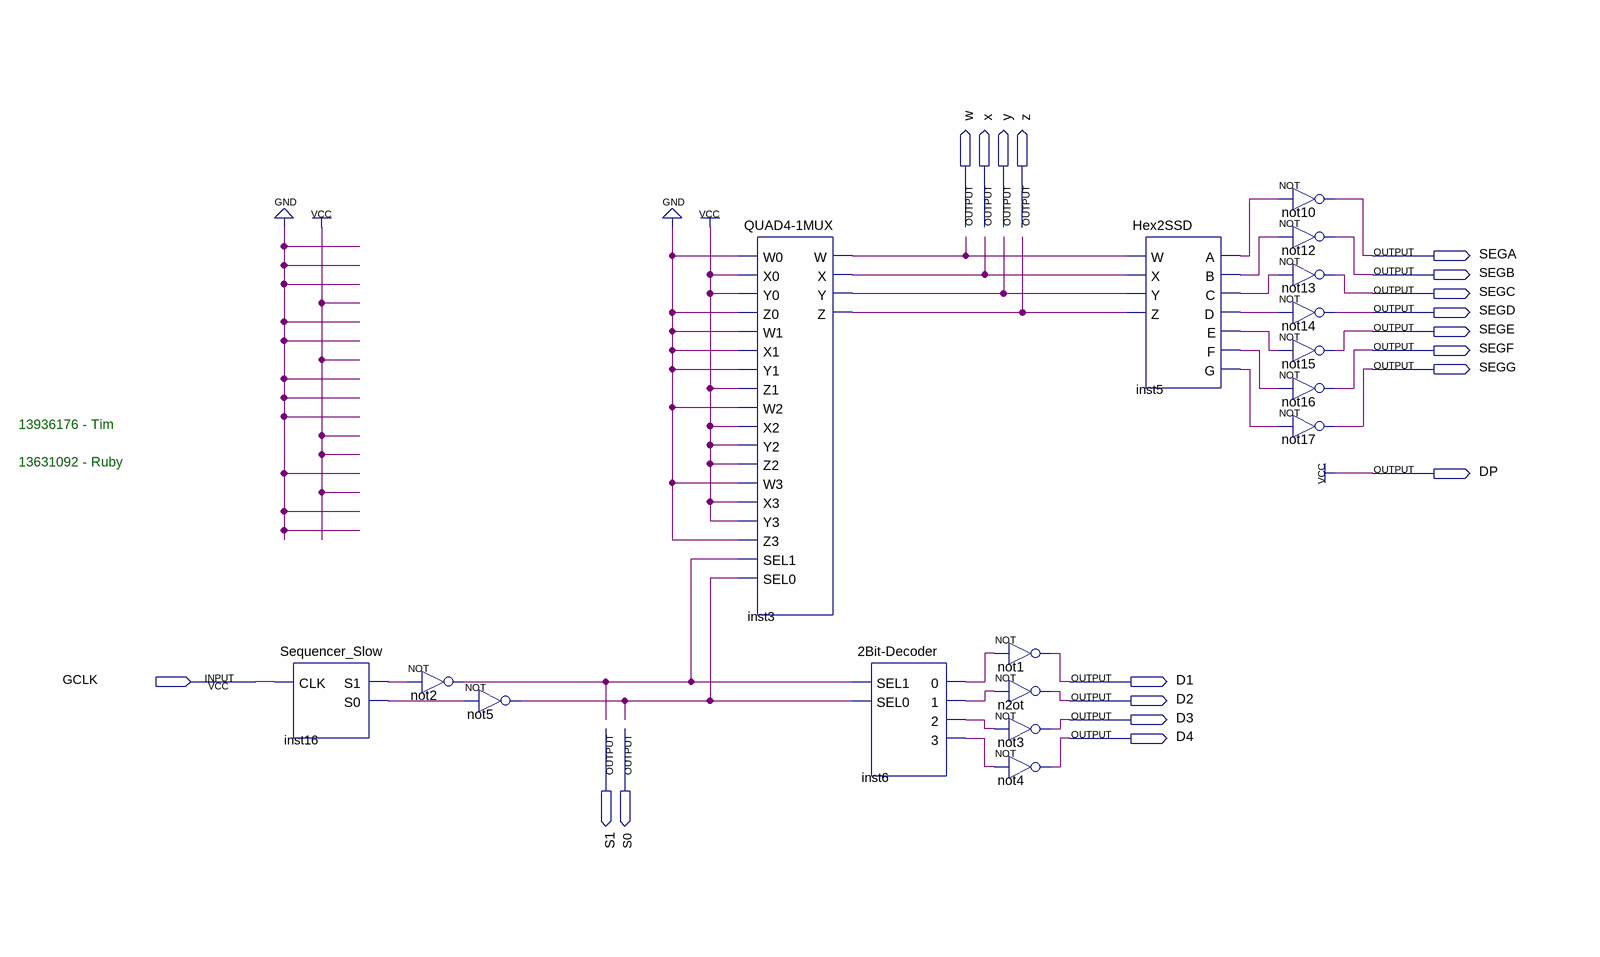
[diagram p0: schematic sheet]
// Quartus schematic sIDDisplay.bdf as structural Verilog: 17 symbols, 19 pins
module sIDDisplay (
  input  GCLK,
  output w,
  output x,
  output y,
  output z,
  output SEGA,
  output SEGB,
  output SEGC,
  output SEGD,
  output SEGE,
  output SEGF,
  output SEGG,
  output DP,
  output D1,
  output D2,
  output D3,
  output S1,
  output S0,
  output D4
);

  wire inst3_w, inst3_x, inst3_y, inst3_z, inst5_a, inst5_b, inst5_c, inst5_d, inst5_e, inst5_f, inst5_g,
       inst6_0, inst6_1, inst6_2, inst6_3, inst16_s0, inst16_s1, not2_out, not5_out;

  Sequencer_Slow inst16 (.CLK(GCLK), .S1(inst16_s1), .S0(inst16_s0));
  not not2 (not2_out, inst16_s1);
  not not5 (not5_out, inst16_s0);
  \QUAD4-1MUX  inst3 (
    .W0(1'b0), .X0(1'b1), .Y0(1'b1), .Z0(1'b0), .W1(1'b0), .X1(1'b0), .Y1(1'b0), .Z1(1'b1), .W2(1'b0),
    .X2(1'b1), .Y2(1'b1), .Z2(1'b1), .W3(1'b0), .X3(1'b1), .Y3(1'b1), .Z3(1'b0), .SEL1(not2_out),
    .SEL0(not5_out), .W(inst3_w), .X(inst3_x), .Y(inst3_y), .Z(inst3_z));
  \2Bit-Decoder  inst6 (.SEL1(not2_out), .SEL0(not5_out), .\0 (inst6_0), .\1 (inst6_1), .\2 (inst6_2), .\3 (inst6_3));
  not not1 (D1, inst6_0);
  not n2ot (D2, inst6_1);
  not not3 (D3, inst6_2);
  not not4 (D4, inst6_3);
  Hex2SSD inst5 (
    .W(inst3_w), .X(inst3_x), .Y(inst3_y), .Z(inst3_z), .A(inst5_a), .B(inst5_b), .C(inst5_c), .D(inst5_d),
    .E(inst5_e), .F(inst5_f), .G(inst5_g));
  not not10 (SEGA, inst5_a);
  not not12 (SEGB, inst5_b);
  not not13 (SEGC, inst5_c);
  not not14 (SEGD, inst5_d);
  not not15 (SEGE, inst5_e);
  not not16 (SEGF, inst5_f);
  not not17 (SEGG, inst5_g);

  assign DP = 1'b1;

  // Notes on the sheet:
  //   13936176 - Tim
  //   13631092 - Ruby
endmodule
